# EAGLE design PedestrianController (EAGLE 8.7.1)
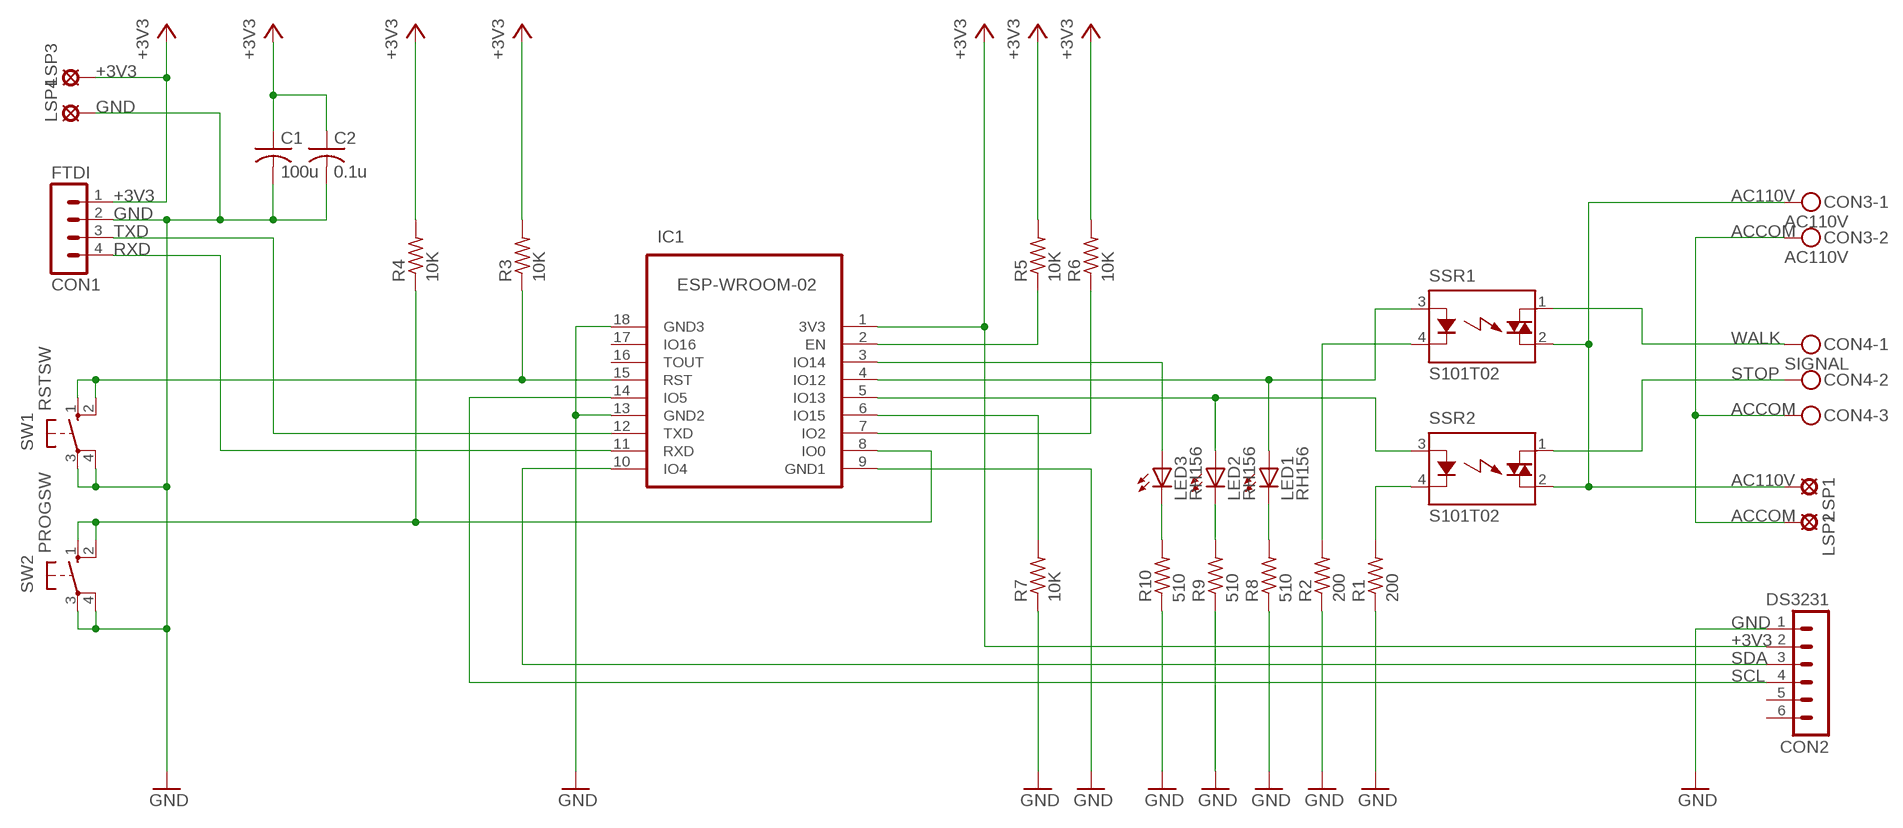
[diagram p0: schematic, sheet 1]

## Parts
C1  100u  C-US050-024X044  [C050-024X044]
C2  0.1u  C-US050-024X044  [C050-024X044]
CON1  FTDI  MA04-1  [MA04-1]
CON2  DS3231  MA06-1  [MA06-1]
CON3  AC110V  MKDSN1,5/2-5,08  [MKDSN1,5/2-5,08]
CON4  SIGNAL  MKDSN1,5/3-5,08  [MKDSN1,5/3-5,08]
IC1  ESP-WROOM-02  ESP-WROOM-02FRONT-FACE  [FRONT-FACE]
LED1  RH156  TLLR4400  [LED3MM]
LED2  RH156  TLLR4400  [LED3MM]
LED3  RH156  TLLR4400  [LED3MM]
LSP1  LSP10  [LSP10]
LSP2  LSP10  [LSP10]
LSP3  LSP10  [LSP10]
LSP4  LSP10  [LSP10]
R1  200  R-US_0204/7  [0204/7]
R2  200  R-US_0204/7  [0204/7]
R3  10K  R-US_0204/7  [0204/7]
R4  10K  R-US_0204/7  [0204/7]
R5  10K  R-US_0204/7  [0204/7]
R6  10K  R-US_0204/7  [0204/7]
R7  10K  R-US_0204/7  [0204/7]
R8  510  R-US_0204/7  [0204/7]
R9  510  R-US_0204/7  [0204/7]
R10  510  R-US_0204/7  [0204/7]
SSR1  S101T02  [S102T0X]
SSR2  S101T02  [S102T0X]
SW1  RSTSW  10-XX  [B3F-10XX]
SW2  PROGSW  10-XX  [B3F-10XX]

## Nets
+3V3: C1.1 C2.1 CON1.1 CON2.2 IC1.1(3V3) LSP3.MP R3.2 R4.2 R5.2 R6.2
AC110V [AC110V]: CON3.1 LSP1.MP SSR1.2(DS2) SSR2.2(DS2)
ACCOM [AC110V]: CON3.2 CON4.3 LSP2.MP
GND: C1.2 C2.2 CON1.2 CON2.1 IC1.9(GND1) IC1.13(GND2) IC1.18(GND3) LSP4.MP R1.1 R2.1 R7.1 R8.1 R9.1 R10.1 SW1.3(P) SW1.4(P1) SW2.3(P) SW2.4(P1)
N$1: IC1.8(IO0) R4.1 SW2.1(S) SW2.2(S1)
N$2: IC1.5(IO13) LED2.A SSR2.3(A)
N$3: R2.2 SSR1.4(K)
N$4: R1.2 SSR2.4(K)
N$5: LED1.K(C) R8.2
N$6: LED2.K(C) R9.2
N$8: IC1.3(IO14) LED3.A
N$9: IC1.4(IO12) LED1.A SSR1.3(A)
N$10: IC1.15(RST) R3.1 SW1.1(S) SW1.2(S1)
N$11: LED3.K(C) R10.2
N$13: IC1.2(EN) R5.1
N$14: IC1.7(IO2) R6.1
N$15: IC1.6(IO15) R7.2
RXD: CON1.4 IC1.11(RXD)
SCL: CON2.4 IC1.14(IO5)
SDA: CON2.3 IC1.10(IO4)
STOP [AC110V]: CON4.2 SSR2.1(DS1)
TXD: CON1.3 IC1.12(TXD)
WALK [AC110V]: CON4.1 SSR1.1(DS1)
Unconnected: CON2.5 CON2.6 IC1.16(TOUT) IC1.17(IO16)

## Library data of the parts
C1 C2 = PedestrianController:C-US: CAPACITOR, American symbol
CON1 = PedestrianController:MA04-1: PIN HEADER; OC_FARNELL: unknown; OC_NEWARK: unknown
CON2 = PedestrianController:MA06-1: PIN HEADER; OC_FARNELL: unknown; OC_NEWARK: unknown
CON3 = PedestrianController:MKDSN1,5/2-5,08: MKDSN 1,5/ 2-5,08 Printklemme Nennstrom: 13,5 A Nennspannung: 250 V Rastermaß: 5,08 mm Polzahl: 2 Anschlussart: Schraubanschluss Montage: Löten Anschlussrichtung Leiter/Platine: 0 ° Artikelnummer: 1729128 Source: http://eshop.phoenixcontact.com .. 1729128.pdf
CON4 = PedestrianController:MKDSN1,5/3-5,08: MKDSN 1,5/ 3-5,08 Printklemme Nennstrom: 13,5 A Nennspannung: 250 V Rastermaß: 5,08 mm Polzahl: 3 Anschlussart: Schraubanschluss Montage: Löten Anschlussrichtung Leiter/Platine: 0 ° Artikelnummer: 1729131 Source: http://eshop.phoenixcontact.com .. 1729131.pdf
IC1 = PedestrianController:ESP-WROOM-02: WiFi module - ESP-WROOM-02
LED1-LED3 = PedestrianController:TLLR4400: Low Current (2mA) LED 3 mm Tinted Diffused Package color RED Source: Data sheet <http://www.farnell.com/datasheets/391100.pdf>; MF: VISHAY SEMICONDUCTOR; OC_FARNELL: 1612437
LSP1-LSP4 = PedestrianController:LSP10: SOLDER PAD drill 1.0 mm, distributor Buerklin, 12H555
R1-R9 = PedestrianController:R-US_: RESISTOR, American symbol
R10 = PedestrianController:R-US_: RESISTOR, American symbol; SPICEPREFIX: R
SSR1 SSR2 = PedestrianController:S?*: Low Height Type Solid State Relays SHARP Source: 162574-da-01-en-S202T02_Solid_State_Relais.pdf Source: http://sharp-world.com .. s102s11_e.pdf; OC_FARNELL: unknown; OC_NEWARK: unknown
SW1 SW2 = PedestrianController:10-XX: OMRON SWITCH; MPN: B3F-1000; OC_FARNELL: 176432; OC_NEWARK: 36M3542

## Net classes
1 AC110V: width 1.524 mm, clearance 0.813 mm

## Board
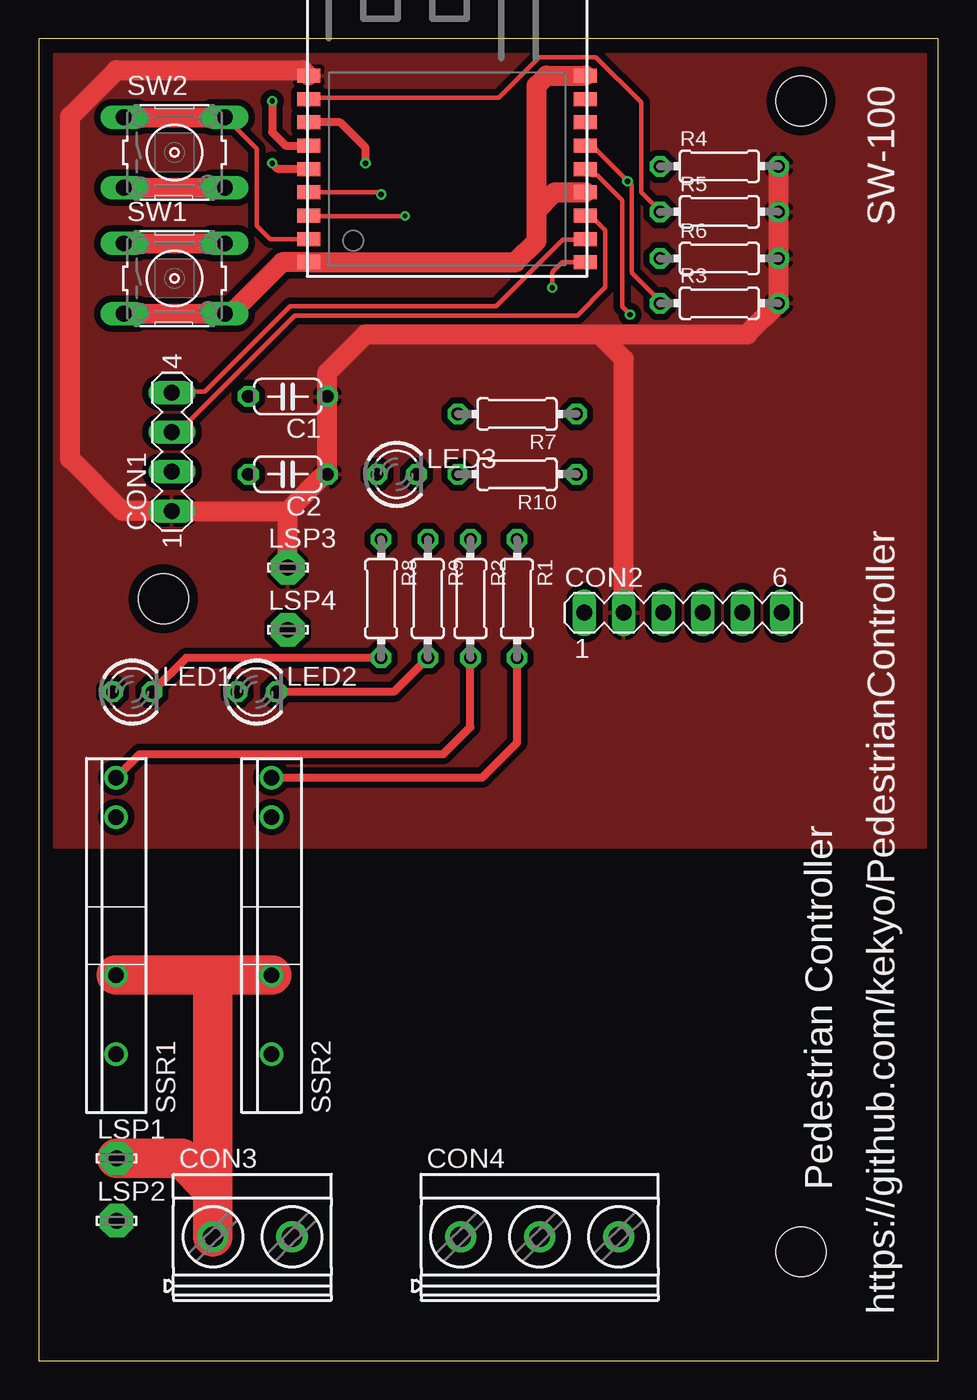
[diagram p1: board, top side]
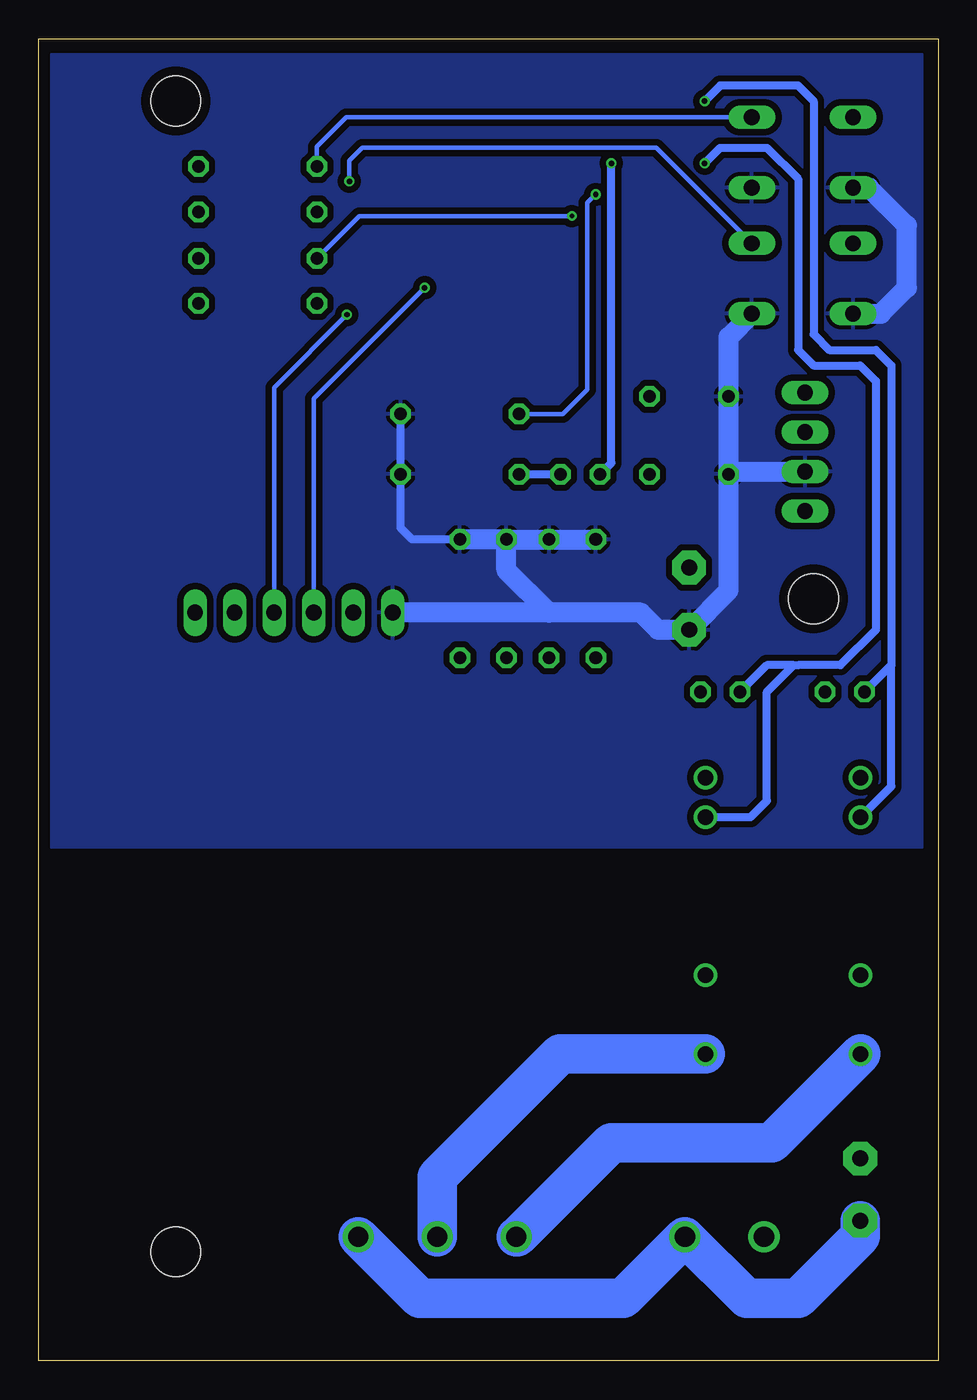
[diagram p2: board, bottom side, seen from below]

Size 57.8 x 85 mm. Coordinates in mm from the lower left corner, seen from the top.
Outline: 0,0 57.8,0 57.8,85 0,85 0,0
Copper layers (1*16): Top 0.035mm / dielectric 1.5mm / Bottom 0.035mm
Design rules "SeeedStudio_2layer_DRU_no_angle_20140221 *": minimum track width 12mil, minimum drill 12mil, track to track 12mil, track to pad 12mil, pad to pad 6mil, via to via 12mil, smd to smd 0mil, copper to edge 24mil, drill to drill 12mil, minimum pad ring 10mil, minimum via ring 6mil, stop-mask expansion 2mil, vias tented up to drill 100mil, thermal gap 10mil
Holes 3.2 mm at 8,49 49,7 49,81

### Footprints (pad centres in the part's own frame; a part is rotated, then mirrored left to right if it is on the bottom)
C050-024X044 = drill 0.813 octagon: 1 -2.54,0; 2 2.54,0
MA04-1 = drill 1.016 long: 1 -3.81,0; 2 -1.27,0; 3 1.27,0; 4 3.81,0
MA06-1 = drill 1.016 long: 1 -6.35,0; 2 -3.81,0; 3 -1.27,0; 4 1.27,0; 5 3.81,0; 6 6.35,0
MKDSN1,5/2-5,08 = drill 1.3 pad 2: 1 -2.561,0.025; 2 2.519,0.025
MKDSN1,5/3-5,08 = drill 1.3 pad 2: 1 -7.641,0.025; 2 -2.561,0.025; 3 2.519,0.025
FRONT-FACE = smd 1.485 x 0.9: 1 -8.893,4.9; 2 -8.893,3.4; 3 -8.893,1.9; 4 -8.893,0.4; 5 -8.893,-1.1; 6 -8.893,-2.6; 7 -8.893,-4.1; 8 -8.893,-5.6; 9 -8.893,-7.1; 10 8.893,-7.1; 11 8.893,-5.6; 12 8.893,-4.1; 13 8.893,-2.6; 14 8.893,-1.1; 15 8.893,0.4; 16 8.893,1.9; 17 8.893,3.4; 18 8.893,4.9
LED3MM = drill 0.813 octagon: A -1.27,0; K 1.27,0
LSP10 = drill 1.016 pad 2.159 octagon: MP 0,0
0204/7 = drill 0.813 octagon: 1 -3.81,0; 2 3.81,0
S102T0X = drill 1: 1 -7.62,0; 2 -2.54,0; 3 7.62,0; 4 10.16,0
B3F-10XX = drill 1.016 long: 1 -3.251,2.261; 2 3.251,2.261; 3 -3.251,-2.261; 4 3.251,-2.261

### Placement (x,y rotation side)
C1  16,62 180 top
C2  16,57 180 top
CON1  8.55,58.45 90 top
CON2  41.41,48.1 0 top
CON3  13.75,7.94 0 top
CON4  34.75,7.94 0 top
IC1  26.24,77.73 0 top
LED1  6,43 0 top
LED2  14,43 0 top
LED3  23,57 0 top
LSP1  5,13 0 top
LSP2  5,9 0 top
LSP3  16,51 0 top
LSP4  16,47 0 top
R1  30.74,49 270 top
R2  27.74,49 270 top
R3  43.74,68 0 top
R4  43.74,76.8 0 top
R5  43.74,73.88 0 top
R6  43.74,70.88 0 top
R7  30.74,60.88 180 top
R8  22,49 270 top
R9  25,49 270 top
R10  30.74,57 180 top
SSR1  4.97,27.34 90 top
SSR2  14.96,27.34 90 top
SW1  8.71,69.59 0 top
SW2  8.71,77.7 0 top

### Tracks (layer width: path | path; a pad name or v marks a point on that pad's centre or on a via)
+3V3
  Top 0.305: 47.55,73.76 R5.2 | 47.55,71.02 47.55,71 R6.2
  Top 1.27: 47.55,71 R3.2 45.55,66 36,66 | R6.2 R5.2 R4.2 | 36,66 21,66 18.54,63.54 C1.1 C2.1 18.36,57 16,54.64 | IC1.1 16.98,83 5,83 2,80 2,58 5.36,54.64 CON1.1 16,54.64 | LSP3.MP 16,54.64 | CON2.2 37.6,64.4 36,66
  pour Top (isolate 0.406): 1,84 57,84 57,33 1,33
AC110V
  Top 2.54: 13.79,24.8 SSR2.2 11,24.8 | SSR1.2 11,24.8 | 11,24.8 11.19,24.61 11.19,11 | CON3.1 11.19,11 | LSP1.MP 9.19,13 11.19,11
ACCOM
  Bottom 2.54: CON4.3 33.3,4 20.23,4 CON3.2 12.3,4 9,4 5,8 LSP2.MP
GND
  Top 1.27: 32,74 32,72 30.64,70.64 IC1.9 15.63,70.64 12.33,67.33 SW1.4 SW1.3 | 32,74 33.13,75.14 IC1.13 | IC1.18 32.63,82.64 32,82 32,74 | SW2.3 SW2.4
  Bottom 0.508: R1.1 33.81,52.81 34.55,53.55 R10.1 R7.1
  Bottom 1.27: SW2.3 4.44,75.44 2,73 2,69 3.67,67.33 SW1.3 | C2.2 13.46,49.54 LSP4.MP 18,47 19.1,48.1 25,48.1 | C2.2 13.28,57.18 CON1.2 | C2.2 C1.2 13.46,65.84 SW1.4 | 25,48.1 CON2.1 | 25,48.1 27.74,50.84 R2.1 | R2.1 R9.1 R8.1 | R2.1 R1.1
  pour Bottom (isolate 0.406): 1,84 57,84 57,33 1,33
N$1
  Top 0.305: 16.76,72.24 17.22,72.24 IC1.8 14.87,72.14 14,73 14,77.93 SW2.2
  Top 1.27: SW2.1 SW2.2
  Bottom 0.305: SW2.2 38.04,79.96 39.93,78.07 R4.1
N$2  (via drill 0.35)
  Top 0.305: 17.22,76.66 IC1.5
  Top 0.508: IC1.5 15.37,76.64 v15,77
  Bottom 0.508: v15,77 14,78 11,78 9,76 9,65 8,64 5,64 4,63 4,47 6.27,44.73 9,44.73 9.27,44.73 | SSR2.3 12.04,34.95 11,36 11,43 9.27,44.73 | LED2.A 11,44.73 9.27,44.73
N$3
  Top 0.508: SSR1.4 6.47,39 26,39 27.74,40.74 R2.2
N$4
  Top 0.508: SSR2.4 28.5,37.49 30.74,39.74 R1.2
N$5
  Top 0.508: R8.2 9.46,45.19 LED1.K
N$6
  Top 0.508: R9.2 22.81,43 LED2.K
N$8  (via drill 0.35)
  Top 0.508: v21,77 21,78 19.36,79.64 IC1.3
  Bottom 0.508: LED3.A 21,57.73 v21,77
N$9  (via drill 0.35)
  Top 0.508: 16.86,78.14 IC1.4 15.87,78.14 15,79 v15,81
  Bottom 0.508: SSR1.3 3,36.92 3,44.73 | 3,44.73 3,64 4,65 7,65 8,66 8,81 9,82 14,82 v15,81 | 3,44.73 LED1.A
N$10  (via drill 0.35)
  Top 0.305: IC1.15 35.2,78.03 35.66,78.03 v37.84,75.84 38.1,75.59 38.1,69.95 39.93,68.12 R3.1
  Top 1.27: SW1.1 SW1.2
  Bottom 0.305: SW1.2 18.12,78 37,78 37.84,77.16 v37.84,75.84
N$11
  Bottom 0.508: R10.2 LED3.K
N$13
  Top 0.305: IC1.2 17.37,81.23 29.57,81.23 32.16,83.82 35.81,83.82 38.71,80.92 38.71,75.13 39.93,73.91 R5.1
N$14  (via drill 0.3)
  Top 0.305: v23.54,73.61 17.37,73.61 IC1.7
  Bottom 0.305: R6.1 37.2,73.61 v23.54,73.61
N$15  (via drill 0.35)
  Top 0.305: IC1.6 21.86,75.14 v22,75
  Bottom 0.305: v22,75 22.55,74.45 22.55,62.45 24.12,60.88 R7.2
RXD
  Top 0.305: IC1.11 35.05,72.08 33.68,72.08 29.41,67.82 16.15,67.82 10.67,62.33 8.69,62.33 CON1.4
SCL  (via drill 0.35)
  Top 0.305: IC1.14 35.54,76.23 35.88,76.23 37.49,74.62 37.49,67.78 v38,67.27
  Bottom 0.305: v38,67.27 42.68,62.59 CON2.4
SDA  (via drill 0.35)
  Top 0.305: IC1.10 33.63,70.64 33,70 v33,69
  Bottom 0.305: CON2.3 40.14,61.86 v33,69
STOP
  Bottom 2.54: CON4.2 32.19,11.81 24.29,19.71 SSR2.1
TXD
  Top 0.305: IC1.12 35.2,73.61 35.51,73.61 36.42,72.69 36.42,69.04 34.59,67.21 16.46,67.21 8.99,59.74 8.69,59.74 CON1.3
WALK
  Bottom 2.54: SSR1.1 10.69,14 21,14 27.04,7.96 CON4.1

### Text on the board
tPlace: SW-100 | Pedestrian Controller | https://github.com/kekyo/PedestrianController